# EAGLE schematic MultiDrop (EAGLE 7.6.0)
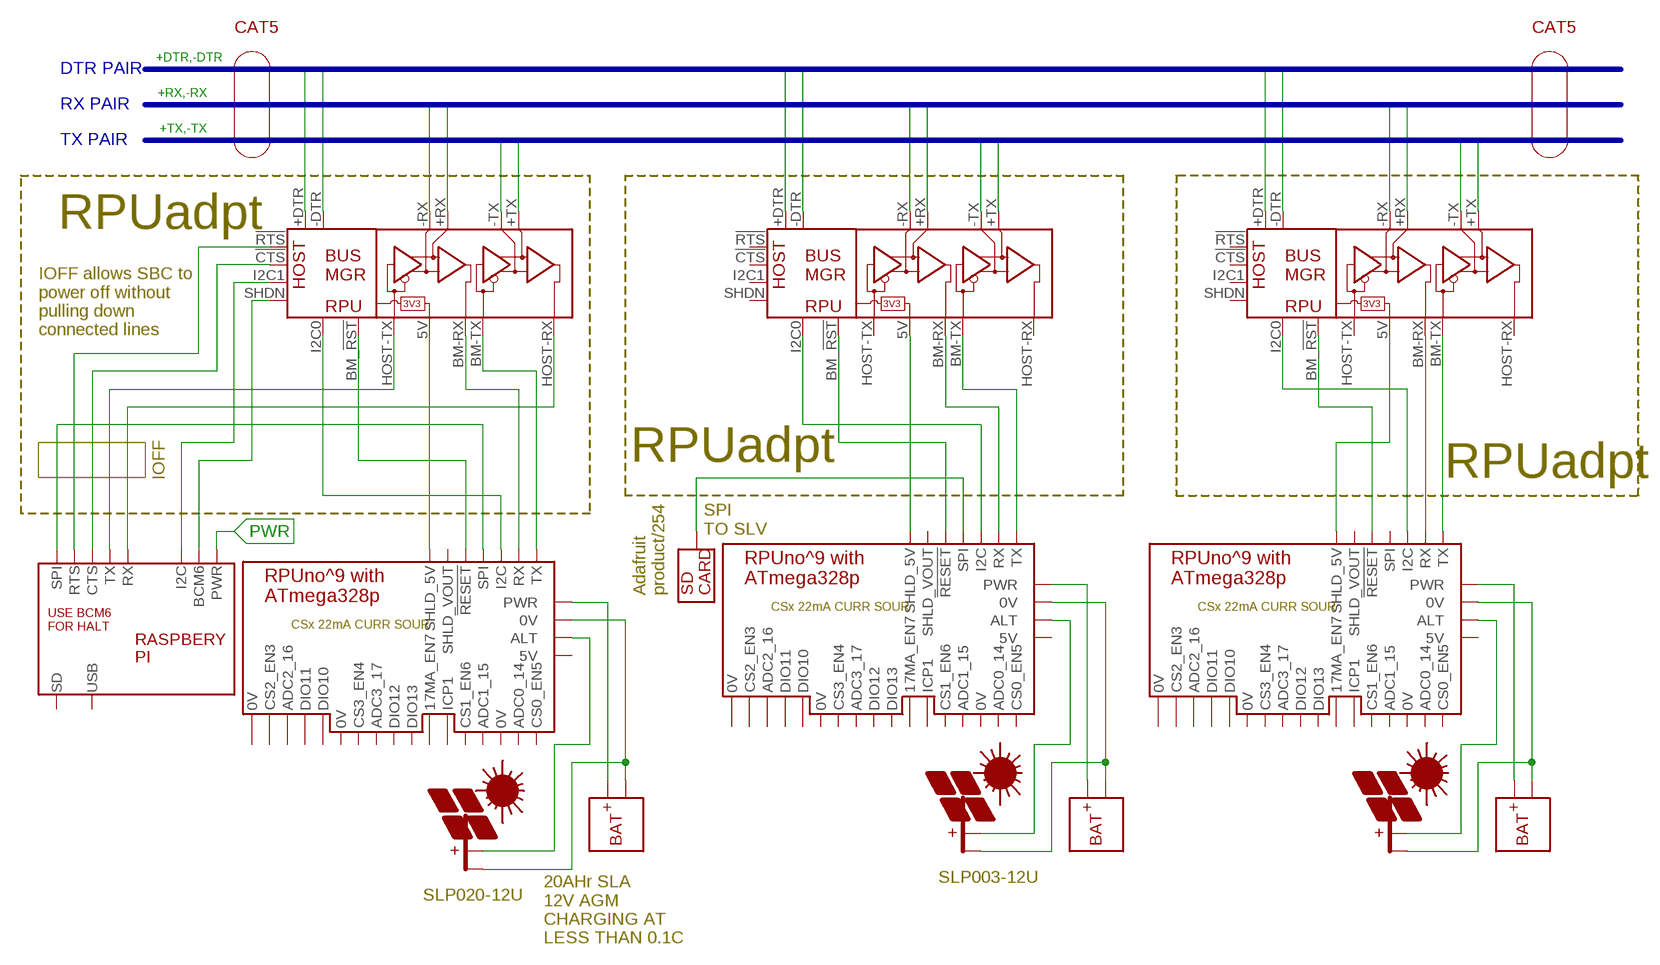
[diagram p0: schematic, sheet 1]

## Parts
BM1  RPUNO  [NA-30]
BM2  RPUNO  [NA-30]
BM3  RPUNO  [NA-30]
PV1  PV  [NA-30]
PV2  PV  [NA-30]
PV3  PV  [NA-30]
SD1  SD  [NA-30]
U$1  BUS_MGR  [WITH_RPU_NAMES]
U$2  BUS_MGR  [WITH_RPU_NAMES]
U$3  BAT  [NA-30]
U$4  BUS_MGR  [WITH_RPU_NAMES]
U$5  BAT  [NA-30]
U$7  PI  [NA-30]
U$9  BAT  [NA-30]

## Nets
+DTR: U$1.+DTR
+DTR1: U$2.+DTR
+DTR3: U$4.+DTR
+RX: U$1.+RX
+RX1: U$2.+RX
+RX3: U$4.+RX
+TX: U$1.+TX
+TX1: U$2.+TX
+TX3: U$4.+TX
-DTR: U$1.-DTR
-DTR1: U$2.-DTR
-DTR3: U$4.-DTR
-RX: U$1.-RX
-RX1: U$2.-RX
-RX3: U$4.-RX
-TX: U$1.-TX
-TX1: U$2.-TX
-TX3: U$4.-TX
N$1: BM2.1(TX) U$1.BM-TX(BM_TX)
N$2: BM2.2(RX) U$1.BM-RX(BM_RX)
N$3: BM2.4(SPI) U$7.10(SPI)
N$4: U$1.!CTS U$7.1(CTS)
N$5: U$1.!RTS U$7.2(RTS)
N$6: U$1.SHDN U$7.7(BCM6)
N$7: U$1.I2C1 U$7.8(I2C)
N$8: U$1.HOST-RX(HOST_RX) U$7.3(RX)
N$9: U$1.HOST-TX(HOST_TX) U$7.4(TX)
N$10: BM1.1(TX) U$2.BM-TX(BM_TX)
N$11: BM1.2(RX) U$2.BM-RX(BM_RX)
N$12: BM2.8(PWR) U$9.1(+BAT)
N$13: BM3.6(SHLD_5V) U$4.5V(PWR)
N$14: BM3.1(TX) U$4.BM-TX(BM_TX)
N$15: BM2.9(0V) PV2.2(-PV) U$9.2(-BAT)
N$16: BM1.20(ALT) PV1.1(+PV)
N$17: BM2.20(ALT) PV2.1(+PV)
N$18: BM1.4(SPI) SD1.1(PV_PWR)
N$19: BM1.9(0V) PV1.2(-PV) U$3.2(-BAT)
N$21: BM3.2(RX) U$4.BM-RX(BM_RX)
N$22: BM1.8(PWR) U$3.1(+BAT)
N$24: BM3.20(ALT) PV3.1(+PV)
N$25: BM3.9(0V) PV3.2(-PV) U$5.2(-BAT)
N$26: BM3.8(PWR) U$5.1(+BAT)
N$29: BM2.6(SHLD_5V) U$1.5V(PWR)
N$30: BM2.5(!RESET) U$1.BM_!RST!(BM-!RST!)
N$32: BM3.3(I2C) U$4.I2C0
N$33: BM2.3(I2C) U$1.I2C0
N$43: BM3.5(!RESET) U$4.BM_!RST!(BM-!RST!)
N$44: BM1.5(!RESET) U$2.BM_!RST!(BM-!RST!)
N$45: BM1.6(SHLD_5V) U$2.5V(PWR)
N$48: BM1.3(I2C) U$2.I2C0
PWR: U$7.12(PWR)
Unconnected: BM1.7(SHLD_VOUT) BM1.10(ADC1_15) BM1.11(ADC0_14) BM1.12(ICP1) BM1.13(ADC2_16) BM1.14(DIO11) BM1.15(DIO10) BM1.16(ADC3_17) BM1.17(DIO12) BM1.18(DIO13) BM1.19(5V) BM1.21(17MA_EN7) BM1.22(CS1_EN6) BM1.23(CS0_EN5) BM1.24(CS2_EN3) BM1.26(0V) BM1.27(0V) BM1.28(0V) BM1.29(CS3_EN4) BM2.7(SHLD_VOUT) BM2.10(ADC1_15) BM2.11(ADC0_14) BM2.12(ICP1) BM2.13(ADC2_16) BM2.14(DIO11) BM2.15(DIO10) BM2.16(ADC3_17) BM2.17(DIO12) BM2.18(DIO13) BM2.19(5V) BM2.21(17MA_EN7) BM2.22(CS1_EN6) BM2.23(CS0_EN5) BM2.24(CS2_EN3) BM2.26(0V) BM2.27(0V) BM2.28(0V) BM2.29(CS3_EN4) BM3.4(SPI) BM3.7(SHLD_VOUT) BM3.10(ADC1_15) BM3.11(ADC0_14) BM3.12(ICP1) BM3.13(ADC2_16) BM3.14(DIO11) BM3.15(DIO10) BM3.16(ADC3_17) BM3.17(DIO12) BM3.18(DIO13) BM3.19(5V) BM3.21(17MA_EN7) BM3.22(CS1_EN6) BM3.23(CS0_EN5) BM3.24(CS2_EN3) BM3.26(0V) BM3.27(0V) BM3.28(0V) BM3.29(CS3_EN4) U$2.!CTS U$2.!RTS U$2.HOST-RX(HOST_RX) U$2.HOST-TX(HOST_TX) U$2.I2C1 U$2.SHDN U$4.!CTS U$4.!RTS U$4.HOST-RX(HOST_RX) U$4.HOST-TX(HOST_TX) U$4.I2C1 U$4.SHDN U$7.9(SD) U$7.11(USB)

## Buses
+DTR,-DTR
+RX,-RX
+TX,-TX

## Notes on the sheet
- CAT5 | CAT5
- DTR PAIR
- RX PAIR
- TX PAIR
- RPUadpt
- IOFF allows SBC to
  power off without 
  pulling down 
  connected lines
- RPUadpt
- IOFF | RPUadpt
- SPI
  TO SLV
- Adafruit
  product/254
- SLP003-12U
- SLP020-12U
- 20AHr SLA
  12V AGM
  CHARGING AT
  LESS THAN 0.1C

## Library data of the parts
BM1-BM3 = Documentation:RPUNO: BM /w 328p
PV1-PV3 = Documentation:PV
SD1 = Documentation:SD
U$1 U$2 U$4 = Documentation:BUS_MGR: RPU BUS MANAGER
U$3 U$5 U$9 = Documentation:BAT
U$7 = Documentation:PI: Raspbery Pi